# Altium schematic sheet POWER_2.SchDoc
size 420 x 297 mm; SheetNumber: 6; SheetTotal: 19
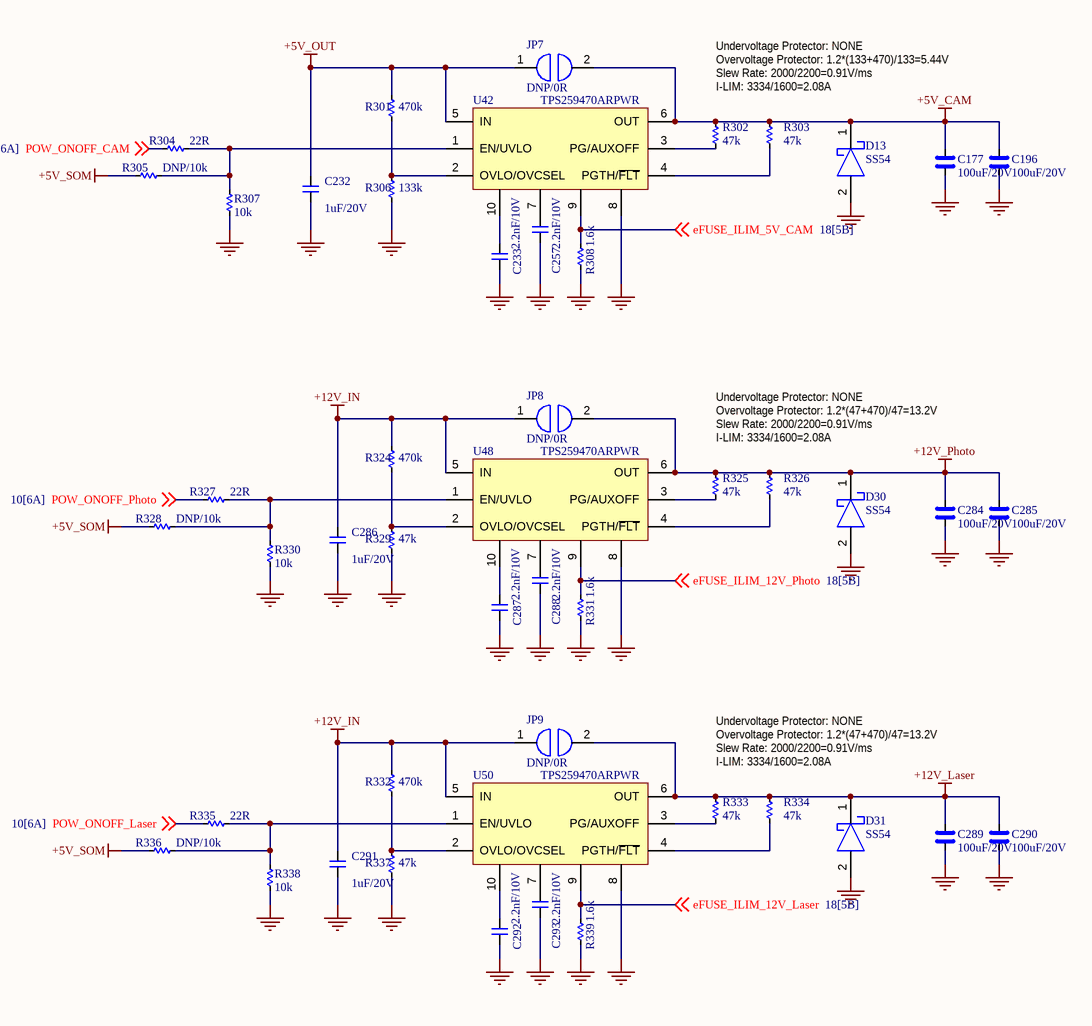
[diagram p0: POWER_2.SchDoc]

## Parts
C177  100uF/20V  [CAP_C_3225X80]
C196  100uF/20V  [CAP_C_3225X80]
C232  1uF/20V  [CAP_C_1005X60]
C233  2.2nF/10V  [CAP_C_1005X60]
C257  2.2nF/10V  [CAP_C_1005X60]
C284  100uF/20V  [CAP_C_3225X80]
C285  100uF/20V  [CAP_C_3225X80]
C286  1uF/20V  [CAP_C_1005X60]
C287  2.2nF/10V  [CAP_C_1005X60]
C288  2.2nF/10V  [CAP_C_1005X60]
C289  100uF/20V  [CAP_C_3225X80]
C290  100uF/20V  [CAP_C_3225X80]
C291  1uF/20V  [CAP_C_1005X60]
C292  2.2nF/10V  [CAP_C_1005X60]
C293  2.2nF/10V  [CAP_C_1005X60]
D13  SS54  [DO-214AC_SMA]
D30  SS54  [DO-214AC_SMA]
D31  SS54  [DO-214AC_SMA]
JP7  DNP/0R  [RES_C_1608X60]
JP8  DNP/0R  [RES_C_1608X60]
JP9  DNP/0R  [RES_C_1608X60]
R301  470k  [RES_C_1005X40]
R302  47k  [RES_C_1005X40]
R303  47k  [RES_C_1005X40]
R304  22R  [RES_C_1005X40]
R305  DNP/10k  [RES_C_1005X40]
R306  133k  [RES_C_1005X40]
R307  10k  [RES_C_1005X40]
R308  1.6k  [RES_C_1005X40]
R324  470k  [RES_C_1005X40]
R325  47k  [RES_C_1005X40]
R326  47k  [RES_C_1005X40]
R327  22R  [RES_C_1005X40]
R328  DNP/10k  [RES_C_1005X40]
R329  47k  [RES_C_1005X40]
R330  10k  [RES_C_1005X40]
R331  1.6k  [RES_C_1005X40]
R332  470k  [RES_C_1005X40]
R333  47k  [RES_C_1005X40]
R334  47k  [RES_C_1005X40]
R335  22R  [RES_C_1005X40]
R336  DNP/10k  [RES_C_1005X40]
R337  47k  [RES_C_1005X40]
R338  10k  [RES_C_1005X40]
R339  1.6k  [RES_C_1005X40]
U42  TPS259470ARPWR  [VQFN-HR-10]
U48  TPS259470ARPWR  [VQFN-HR-10]
U50  TPS259470ARPWR  [VQFN-HR-10]

## Nets
+5V_CAM: C177.2 C196.2 D13.1 JP7.2 R302.2 R303.2 U42.6(OUT)
+5V_OUT: C232.2 JP7.1 R301.2 U42.5(IN)
+5V_SOM: R305.2 R328.2 R336.2
+12V_IN: C286.2 C291.2 JP8.1 JP9.1 R324.2 R332.2 U48.5(IN) U50.5(IN)
+12V_Laser: C289.2 C290.2 D31.1 JP9.2 R333.2 R334.2 U50.6(OUT)
+12V_Photo: C284.2 C285.2 D30.1 JP8.2 R325.2 R326.2 U48.6(OUT)
GND: C177.1 C196.1 C232.1 C233.1 C257.1 C284.1 C285.1 C286.1 C287.1 C288.1 C289.1 C290.1 C291.1 C292.1 C293.1 D13.2 D30.2 D31.2 R306.1 R307.2 R308.1 R329.1 R330.2 R331.1 R337.1 R338.2 R339.1 U42.8 U48.8 U50.8
eFUSE_ILIM_5V_CAM: R308.2 U42.9 ; off-sheet eFUSE_ILIM_5V_CAM
eFUSE_ILIM_12V_Laser: R339.2 U50.9 ; off-sheet eFUSE_ILIM_12V_Laser
eFUSE_ILIM_12V_Photo: R331.2 U48.9 ; off-sheet eFUSE_ILIM_12V_Photo
POW_ONOFF_CAM: R304.2 ; off-sheet POW_ONOFF_CAM
POW_ONOFF_Laser: R335.2 ; off-sheet POW_ONOFF_Laser
POW_ONOFF_Photo: R327.2 ; off-sheet POW_ONOFF_Photo
NetC233_2: C233.2 U42.10
NetC257_2: C257.2 U42.7
NetC287_2: C287.2 U48.10
NetC288_2: C288.2 U48.7
NetC292_2: C292.2 U50.10
NetC293_2: C293.2 U50.7
NetR301_1: R301.1 R306.2 U42.2(OVLO/OVCSEL)
NetR302_1: R302.1 U42.3(PG/AUXOFF)
NetR303_1: R303.1 U42.4(PGTH/~{FLT})
NetR304_1: R304.1 R305.1 R307.1 U42.1(EN/UVLO)
NetR324_1: R324.1 R329.2 U48.2(OVLO/OVCSEL)
NetR325_1: R325.1 U48.3(PG/AUXOFF)
NetR326_1: R326.1 U48.4(PGTH/~{FLT})
NetR327_1: R327.1 R328.1 R330.1 U48.1(EN/UVLO)
NetR332_1: R332.1 R337.2 U50.2(OVLO/OVCSEL)
NetR333_1: R333.1 U50.3(PG/AUXOFF)
NetR334_1: R334.1 U50.4(PGTH/~{FLT})
NetR335_1: R335.1 R336.1 R338.1 U50.1(EN/UVLO)

## Notes on the sheet
- Undervoltage Protector: NONE
- Overvoltage Protector: 1.2*(133+470)/133=5.44V
- Slew Rate: 2000/2200=0.91V/ms
- I-LIM: 3334/1600=2.08A
- Overvoltage Protector: 1.2*(47+470)/47=13.2V
- Project:
- Sub-system:
- Design by:
- Sheet title:
- Sheet
- of
- Checked by:
- Approved by:
- Revision:
- Document No:
- Size:
- Date:
- A3

## Library data of the parts
C177 C196 C284 C285 C289 C290 = _CAP_C_High_2: CAP CHIP High Value
C232 C233 C257 C286-C288 C291-C293 = _CAP_C_2: CAP CHIP
D13 D30 D31 = SS54: DIODE SCHOTTKY 60V 3A DO214AA
JP7-JP9 = JUMPER
R301-R308 R324-R339 = _RES_B_2: RES